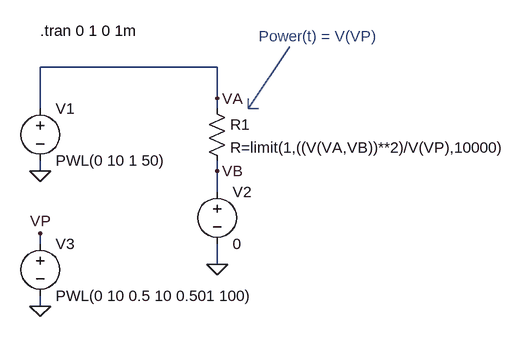
[diagram p0: schematic dyn_power.asc]
dyn_power.asc, the LTspice schematic file:
Version 4
SHEET 1 880 680
WIRE 208 64 -64 64
WIRE 208 112 208 64
WIRE -64 128 -64 64
WIRE 208 128 208 112
WIRE -64 224 -64 208
WIRE 208 224 208 208
WIRE 208 256 208 224
WIRE -64 336 -64 320
WIRE 208 368 208 336
WIRE -64 432 -64 416
FLAG 208 368 0
FLAG -64 224 0
FLAG 208 112 VA
FLAG 208 224 VB
FLAG -64 432 0
FLAG -64 320 VP
SYMBOL res 192 112 R0
SYMATTR InstName R1
SYMATTR Value R=limit(1,((V(VA,VB))**2)/V(VP),10000)
SYMBOL voltage -64 112 R0
WINDOW 123 0 0 Left 0
WINDOW 39 0 0 Left 0
SYMATTR InstName V1
SYMATTR Value PWL(0 10 1 50)
SYMBOL voltage 208 240 R0
WINDOW 123 0 0 Left 0
WINDOW 39 0 0 Left 0
SYMATTR InstName V2
SYMATTR Value 0
SYMBOL voltage -64 320 R0
WINDOW 123 0 0 Left 0
WINDOW 39 0 0 Left 0
SYMATTR InstName V3
SYMATTR Value PWL(0 10 0.5 10 0.501 100)
TEXT -64 8 Left 0 !.tran 0 1 0 1m
TEXT 272 16 Left 0 ;Power(t) = V(VP)
LINE Normal 320 32 256 128
LINE Normal 272 128 256 128
LINE Normal 256 128 272 128
LINE Normal 256 112 256 128

The netlist it stands for:
* dyn_power.asc
R1 VA VB R=limit(1,((V(VA,VB))**2)/V(VP),10000)
V1 VA 0 PWL(0 10 1 50)
V2 VB 0 0
V3 VP 0 PWL(0 10 0.5 10 0.501 100)
.tran 0 1 0 1m
* Power(t) = V(VP)
.backanno
.end